# EAGLE schematic vr44-aka-companion (EAGLE 9.6.2)

## Sheet 1 of 3
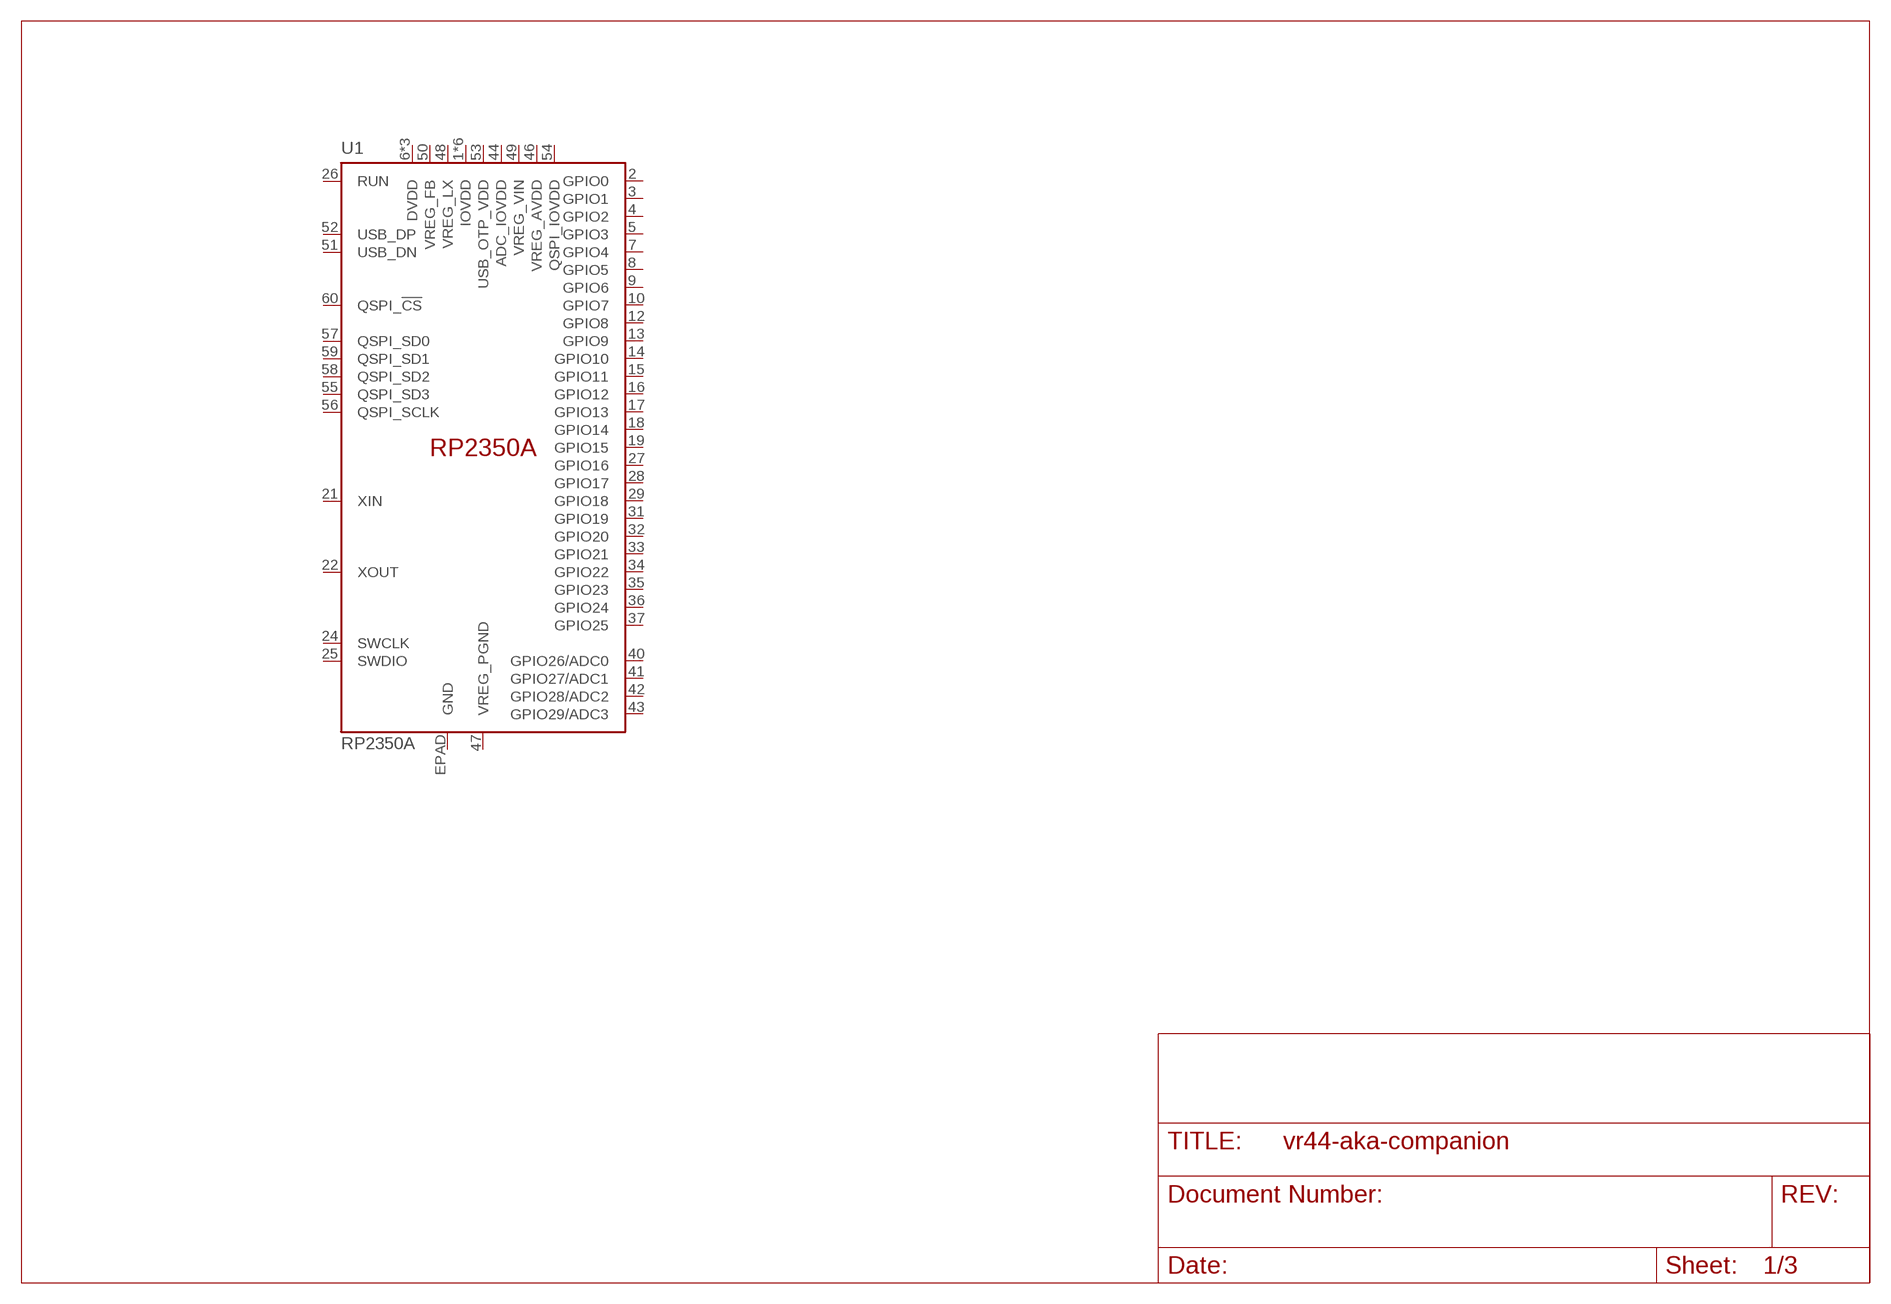
[diagram p0: schematic, sheet 1]

### Parts
U1  RP2350A  [QFN-60]
Unconnected: U1.1(IOVDD) U1.2(GPIO0) U1.3(GPIO1) U1.4(GPIO2) U1.5(GPIO3) U1.6(DVDD) U1.7(GPIO4) U1.8(GPIO5) U1.9(GPIO6) U1.10(GPIO7) U1.11(IOVDD) U1.12(GPIO8) U1.13(GPIO9) U1.14(GPIO10) U1.15(GPIO11) U1.16(GPIO12) U1.17(GPIO13) U1.18(GPIO14) U1.19(GPIO15) U1.20(IOVDD) U1.21(XIN) U1.22(XOUT) U1.23(DVDD) U1.24(SWCLK) U1.25(SWDIO) U1.26(RUN) U1.27(GPIO16) U1.28(GPIO17) U1.29(GPIO18) U1.30(IOVDD) U1.31(GPIO19) U1.32(GPIO20) U1.33(GPIO21) U1.34(GPIO22) U1.35(GPIO23) U1.36(GPIO24) U1.37(GPIO25) U1.38(IOVDD) U1.39(DVDD) U1.40(GPIO26/ADC0) U1.41(GPIO27/ADC1) U1.42(GPIO28/ADC2) U1.43(GPIO29/ADC3) U1.44(ADC_IOVDD) U1.45(IOVDD) U1.46(VREG_AVDD) U1.47(VREG_PGND) U1.48(VREG_LX) U1.49(VREG_VIN) U1.50(VREG_FB) U1.51(USB_DN) U1.52(USB_DP) U1.53(USB_OTP_VDD) U1.54(QSPI_IOVDD) U1.55(QSPI_SD3) U1.56(QSPI_SCLK) U1.57(QSPI_SD0) U1.58(QSPI_SD2) U1.59(QSPI_SD1) U1.60(QSPI_!CS!) U1.EPAD(GND)

## Sheet 2 of 3
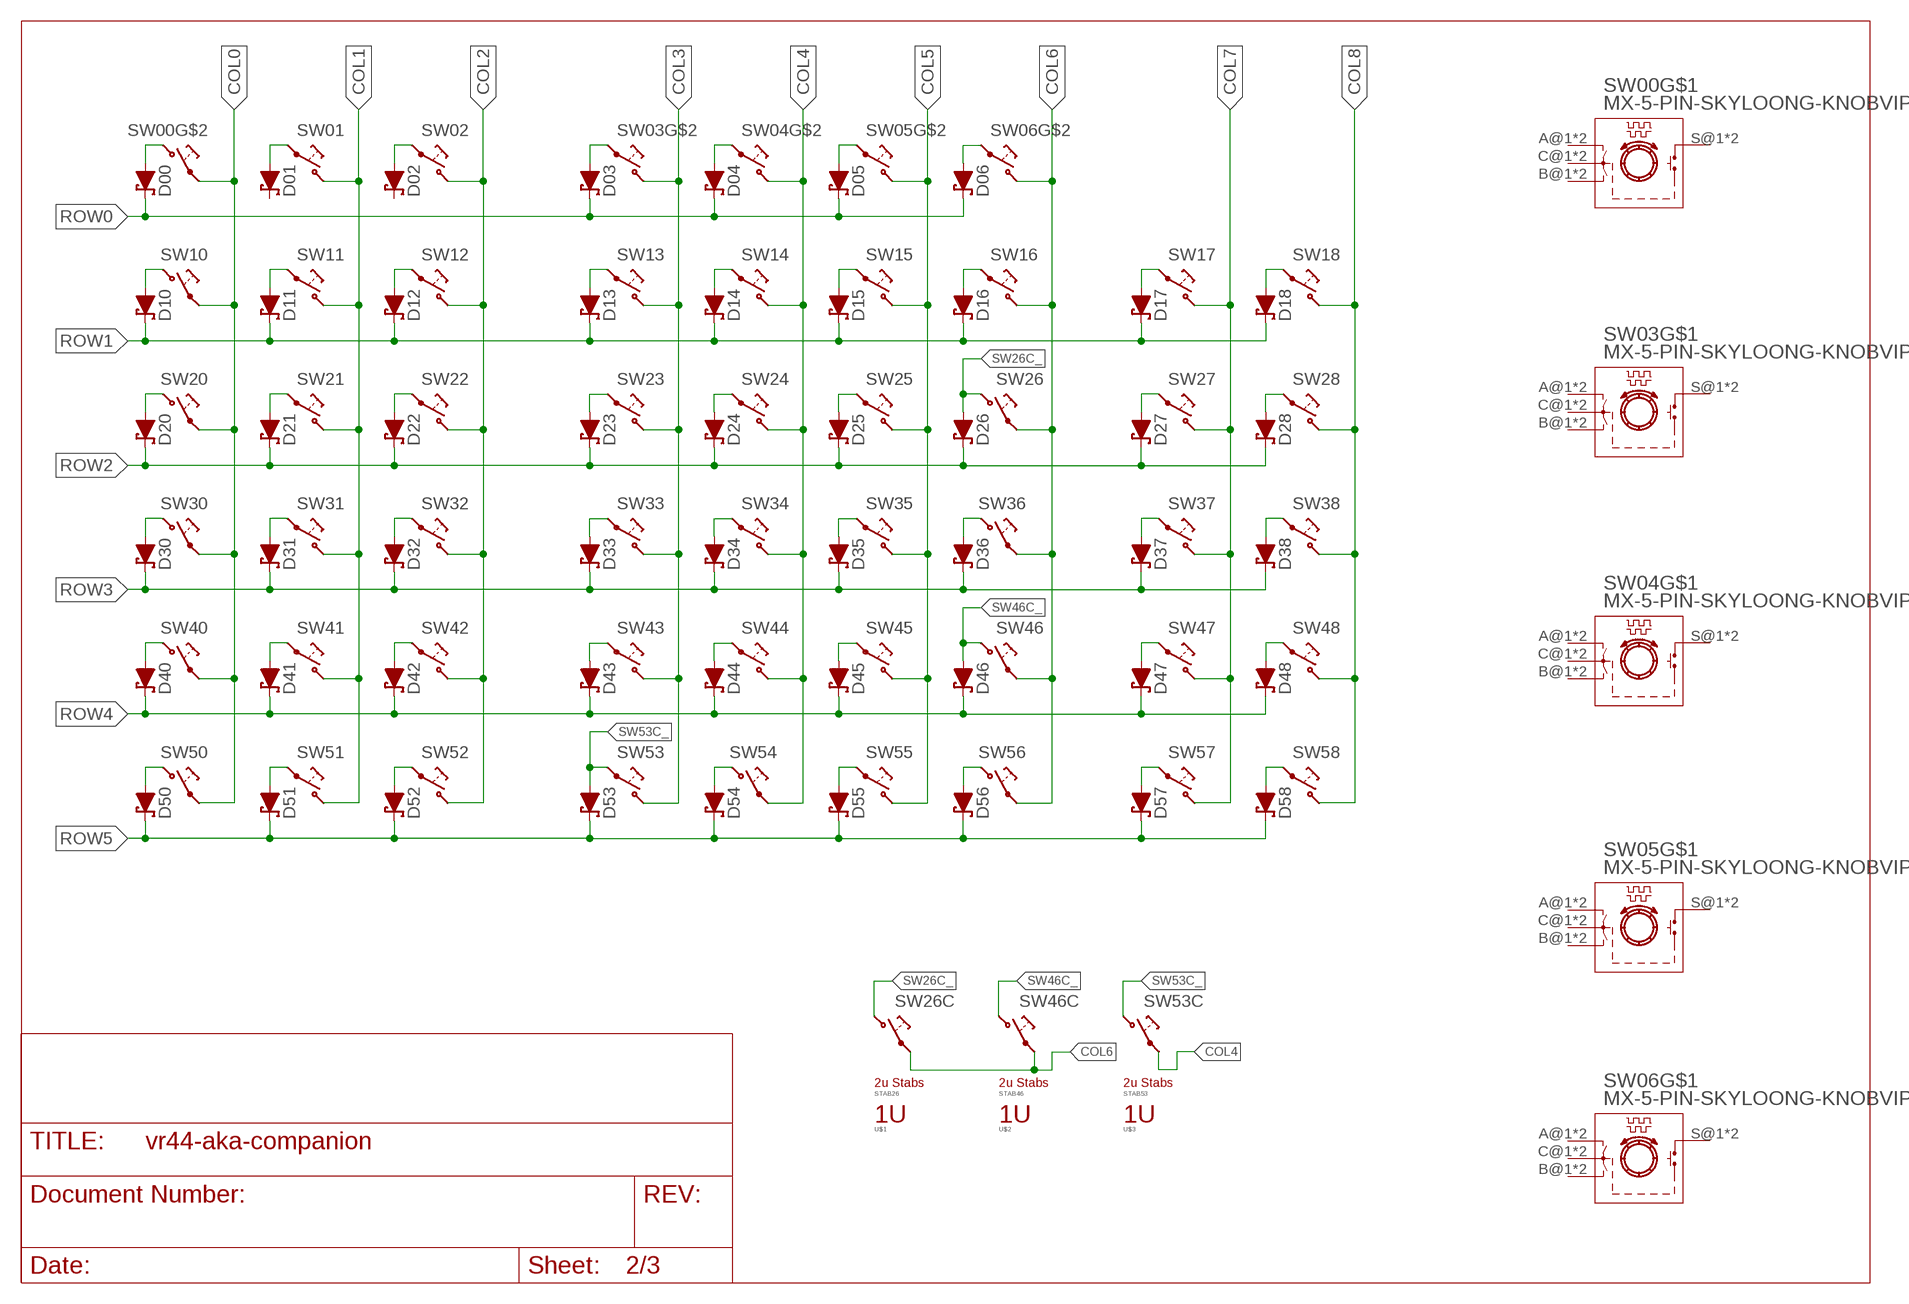
[diagram p1: schematic, sheet 2]

### Parts
D00  1N5819WS  [SOD-123]
D01  1N5819WS  [SOD-123]
D02  1N5819WS  [SOD-123]
D03  1N5819WS  [SOD-123]
D04  1N5819WS  [SOD-123]
D05  1N5819WS  [SOD-123]
D06  1N5819WS  [SOD-123]
D10  1N5819WS  [SOD-123]
D11  1N5819WS  [SOD-123]
D12  1N5819WS  [SOD-123]
D13  1N5819WS  [SOD-123]
D14  1N5819WS  [SOD-123]
D15  1N5819WS  [SOD-123]
D16  1N5819WS  [SOD-123]
D17  1N5819WS  [SOD-123]
D18  1N5819WS  [SOD-123]
D20  1N5819WS  [SOD-123]
D21  1N5819WS  [SOD-123]
D22  1N5819WS  [SOD-123]
D23  1N5819WS  [SOD-123]
D24  1N5819WS  [SOD-123]
D25  1N5819WS  [SOD-123]
D26  1N5819WS  [SOD-123]
D27  1N5819WS  [SOD-123]
D28  1N5819WS  [SOD-123]
D30  1N5819WS  [SOD-123]
D31  1N5819WS  [SOD-123]
D32  1N5819WS  [SOD-123]
D33  1N5819WS  [SOD-123]
D34  1N5819WS  [SOD-123]
D35  1N5819WS  [SOD-123]
D36  1N5819WS  [SOD-123]
D37  1N5819WS  [SOD-123]
D38  1N5819WS  [SOD-123]
D40  1N5819WS  [SOD-123]
D41  1N5819WS  [SOD-123]
D42  1N5819WS  [SOD-123]
D43  1N5819WS  [SOD-123]
D44  1N5819WS  [SOD-123]
D45  1N5819WS  [SOD-123]
D46  1N5819WS  [SOD-123]
D47  1N5819WS  [SOD-123]
D48  1N5819WS  [SOD-123]
D50  1N5819WS  [SOD-123]
D51  1N5819WS  [SOD-123]
D52  1N5819WS  [SOD-123]
D53  1N5819WS  [SOD-123]
D54  1N5819WS  [SOD-123]
D55  1N5819WS  [SOD-123]
D56  1N5819WS  [SOD-123]
D57  1N5819WS  [SOD-123]
D58  1N5819WS  [SOD-123]
STAB26  MX-STABS-200U  [MX-STABS-200U]
STAB46  MX-STABS-200U  [MX-STABS-200U]
STAB53  MX-STABS-200U  [MX-STABS-200U]
SW00  MX-5-PIN-SKYLOONG-KNOBVIP  [MX-5-PIN-SKYLOONG-KNOB-VIP]
SW01  MX-5-PIN-HOTSWAP-VIAVIP  [MX-5-PIN-HOTSWAP-VIA+VIP-NS]
SW02  MX-5-PIN-HOTSWAP-VIAVIP  [MX-5-PIN-HOTSWAP-VIA+VIP-NS]
SW03  MX-5-PIN-SKYLOONG-KNOBVIP  [MX-5-PIN-SKYLOONG-KNOB-VIP]
SW04  MX-5-PIN-SKYLOONG-KNOBVIP  [MX-5-PIN-SKYLOONG-KNOB-VIP]
SW05  MX-5-PIN-SKYLOONG-KNOBVIP  [MX-5-PIN-SKYLOONG-KNOB-VIP]
SW06  MX-5-PIN-SKYLOONG-KNOBVIP  [MX-5-PIN-SKYLOONG-KNOB-VIP]
SW10  MX-5-PIN-HOTSWAP-VIAVIP  [MX-5-PIN-HOTSWAP-VIA+VIP-NS]
SW11  MX-5-PIN-HOTSWAP-VIAVIP  [MX-5-PIN-HOTSWAP-VIA+VIP-NS]
SW12  MX-5-PIN-HOTSWAP-VIAVIP  [MX-5-PIN-HOTSWAP-VIA+VIP-NS]
SW13  MX-5-PIN-HOTSWAP-VIAVIP  [MX-5-PIN-HOTSWAP-VIA+VIP-NS]
SW14  MX-5-PIN-HOTSWAP-VIAVIP  [MX-5-PIN-HOTSWAP-VIA+VIP-NS]
SW15  MX-5-PIN-HOTSWAP-VIAVIP  [MX-5-PIN-HOTSWAP-VIA+VIP-NS]
SW16  MX-5-PIN-HOTSWAP-VIAVIP  [MX-5-PIN-HOTSWAP-VIA+VIP-NS]
SW17  MX-5-PIN-HOTSWAP-VIAVIP  [MX-5-PIN-HOTSWAP-VIA+VIP-NS]
SW18  MX-5-PIN-HOTSWAP-VIAVIP  [MX-5-PIN-HOTSWAP-VIA+VIP-NS]
SW20  MX-5-PIN-HOTSWAP-VIAVIP  [MX-5-PIN-HOTSWAP-VIA+VIP-NS]
SW21  MX-5-PIN-HOTSWAP-VIAVIP  [MX-5-PIN-HOTSWAP-VIA+VIP-NS]
SW22  MX-5-PIN-HOTSWAP-VIAVIP  [MX-5-PIN-HOTSWAP-VIA+VIP-NS]
SW23  MX-5-PIN-HOTSWAP-VIAVIP  [MX-5-PIN-HOTSWAP-VIA+VIP-NS]
SW24  MX-5-PIN-HOTSWAP-VIAVIP  [MX-5-PIN-HOTSWAP-VIA+VIP-NS]
SW25  MX-5-PIN-HOTSWAP-VIAVIP  [MX-5-PIN-HOTSWAP-VIA+VIP-NS]
SW26  MX-5-PIN-HOTSWAP-VIAVIP  [MX-5-PIN-HOTSWAP-VIA+VIP-NS]
SW26C  MX-5-PIN-HOTSWAP-VIAVIP  [MX-5-PIN-HOTSWAP-VIA+VIP-NS]
SW27  MX-5-PIN-HOTSWAP-VIAVIP  [MX-5-PIN-HOTSWAP-VIA+VIP-NS]
SW28  MX-5-PIN-HOTSWAP-VIAVIP  [MX-5-PIN-HOTSWAP-VIA+VIP-NS]
SW30  MX-5-PIN-HOTSWAP-VIAVIP  [MX-5-PIN-HOTSWAP-VIA+VIP-NS]
SW31  MX-5-PIN-HOTSWAP-VIAVIP  [MX-5-PIN-HOTSWAP-VIA+VIP-NS]
SW32  MX-5-PIN-HOTSWAP-VIAVIP  [MX-5-PIN-HOTSWAP-VIA+VIP-NS]
SW33  MX-5-PIN-HOTSWAP-VIAVIP  [MX-5-PIN-HOTSWAP-VIA+VIP-NS]
SW34  MX-5-PIN-HOTSWAP-VIAVIP  [MX-5-PIN-HOTSWAP-VIA+VIP-NS]
SW35  MX-5-PIN-HOTSWAP-VIAVIP  [MX-5-PIN-HOTSWAP-VIA+VIP-NS]
SW36  MX-5-PIN-HOTSWAP-VIAVIP  [MX-5-PIN-HOTSWAP-VIA+VIP-NS]
SW37  MX-5-PIN-HOTSWAP-VIAVIP  [MX-5-PIN-HOTSWAP-VIA+VIP-NS]
SW38  MX-5-PIN-HOTSWAP-VIAVIP  [MX-5-PIN-HOTSWAP-VIA+VIP-NS]
SW40  MX-5-PIN-HOTSWAP-VIAVIP  [MX-5-PIN-HOTSWAP-VIA+VIP-NS]
SW41  MX-5-PIN-HOTSWAP-VIAVIP  [MX-5-PIN-HOTSWAP-VIA+VIP-NS]
SW42  MX-5-PIN-HOTSWAP-VIAVIP  [MX-5-PIN-HOTSWAP-VIA+VIP-NS]
SW43  MX-5-PIN-HOTSWAP-VIAVIP  [MX-5-PIN-HOTSWAP-VIA+VIP-NS]
SW44  MX-5-PIN-HOTSWAP-VIAVIP  [MX-5-PIN-HOTSWAP-VIA+VIP-NS]
SW45  MX-5-PIN-HOTSWAP-VIAVIP  [MX-5-PIN-HOTSWAP-VIA+VIP-NS]
SW46  MX-5-PIN-HOTSWAP-VIAVIP  [MX-5-PIN-HOTSWAP-VIA+VIP-NS]
SW46C  MX-5-PIN-HOTSWAP-VIAVIP  [MX-5-PIN-HOTSWAP-VIA+VIP-NS]
SW47  MX-5-PIN-HOTSWAP-VIAVIP  [MX-5-PIN-HOTSWAP-VIA+VIP-NS]
SW48  MX-5-PIN-HOTSWAP-VIAVIP  [MX-5-PIN-HOTSWAP-VIA+VIP-NS]
SW50  MX-5-PIN-HOTSWAP-VIAVIP  [MX-5-PIN-HOTSWAP-VIA+VIP-NS]
SW51  MX-5-PIN-HOTSWAP-VIAVIP  [MX-5-PIN-HOTSWAP-VIA+VIP-NS]
SW52  MX-5-PIN-HOTSWAP-VIAVIP  [MX-5-PIN-HOTSWAP-VIA+VIP-NS]
SW53  MX-5-PIN-HOTSWAP-VIAVIP  [MX-5-PIN-HOTSWAP-VIA+VIP-NS]
SW53C  MX-5-PIN-HOTSWAP-VIAVIP  [MX-5-PIN-HOTSWAP-VIA+VIP-NS]
SW54  MX-5-PIN-HOTSWAP-VIAVIP  [MX-5-PIN-HOTSWAP-VIA+VIP-NS]
SW55  MX-5-PIN-HOTSWAP-VIAVIP  [MX-5-PIN-HOTSWAP-VIA+VIP-NS]
SW56  MX-5-PIN-HOTSWAP-VIAVIP  [MX-5-PIN-HOTSWAP-VIA+VIP-NS]
SW57  MX-5-PIN-HOTSWAP-VIAVIP  [MX-5-PIN-HOTSWAP-VIA+VIP-NS]
SW58  MX-5-PIN-HOTSWAP-VIAVIP  [MX-5-PIN-HOTSWAP-VIA+VIP-NS]
U$1  MX-FPRINT-100U-PLACE  [MX-FPRINT-PLACE-100U]
U$2  MX-FPRINT-100U-PLACE  [MX-FPRINT-PLACE-100U]
U$3  MX-FPRINT-100U-PLACE  [MX-FPRINT-PLACE-100U]

### Nets
COL0: SW00.1@1 SW00.1@2 SW00.1@3 SW10.1@1 SW10.1@2 SW10.1@3 SW20.1@1 SW20.1@2 SW20.1@3 SW30.1@1 SW30.1@2 SW30.1@3 SW40.1@1 SW40.1@2 SW40.1@3 SW50.1@1 SW50.1@2 SW50.1@3
COL1: SW01.2@1 SW01.2@2 SW01.2@3 SW11.2@1 SW11.2@2 SW11.2@3 SW21.2@1 SW21.2@2 SW21.2@3 SW31.2@1 SW31.2@2 SW31.2@3 SW41.2@1 SW41.2@2 SW41.2@3 SW51.2@1 SW51.2@2 SW51.2@3
COL2: SW02.2@1 SW02.2@2 SW02.2@3 SW12.2@1 SW12.2@2 SW12.2@3 SW22.2@1 SW22.2@2 SW22.2@3 SW32.2@1 SW32.2@2 SW32.2@3 SW42.2@1 SW42.2@2 SW42.2@3 SW52.2@1 SW52.2@2 SW52.2@3
COL3: SW03.2@1 SW03.2@2 SW03.2@3 SW13.2@1 SW13.2@2 SW13.2@3 SW23.2@1 SW23.2@2 SW23.2@3 SW33.2@1 SW33.2@2 SW33.2@3 SW43.2@1 SW43.2@2 SW43.2@3 SW53.2@1 SW53.2@2 SW53.2@3
COL4: SW04.2@1 SW04.2@2 SW04.2@3 SW14.2@1 SW14.2@2 SW14.2@3 SW24.2@1 SW24.2@2 SW24.2@3 SW34.2@1 SW34.2@2 SW34.2@3 SW44.2@1 SW44.2@2 SW44.2@3 SW53C.1@1 SW53C.1@2 SW53C.1@3 SW54.1@1 SW54.1@2 SW54.1@3
COL5: SW05.2@1 SW05.2@2 SW05.2@3 SW15.2@1 SW15.2@2 SW15.2@3 SW25.2@1 SW25.2@2 SW25.2@3 SW35.2@1 SW35.2@2 SW35.2@3 SW45.2@1 SW45.2@2 SW45.2@3 SW55.2@1 SW55.2@2 SW55.2@3
COL6: SW06.2@1 SW06.2@2 SW06.2@3 SW16.2@1 SW16.2@2 SW16.2@3 SW26.1@1 SW26.1@2 SW26.1@3 SW26C.1@1 SW26C.1@2 SW26C.1@3 SW36.1@1 SW36.1@2 SW36.1@3 SW46.1@1 SW46.1@2 SW46.1@3 SW46C.1@1 SW46C.1@2 SW46C.1@3 SW56.1@1 SW56.1@2 SW56.1@3
COL7: SW17.2@1 SW17.2@2 SW17.2@3 SW27.2@1 SW27.2@2 SW27.2@3 SW37.2@1 SW37.2@2 SW37.2@3 SW47.2@1 SW47.2@2 SW47.2@3 SW57.2@1 SW57.2@2 SW57.2@3
COL8: SW18.2@1 SW18.2@2 SW18.2@3 SW28.2@1 SW28.2@2 SW28.2@3 SW38.2@1 SW38.2@2 SW38.2@3 SW48.2@1 SW48.2@2 SW48.2@3 SW58.2@1 SW58.2@2 SW58.2@3
N$1: D00.A SW00.2@1 SW00.2@2 SW00.2@3
N$2: D01.A SW01.1@1 SW01.1@2 SW01.1@3
N$3: D02.A SW02.1@1 SW02.1@2 SW02.1@3
N$4: D55.A SW55.1@1 SW55.1@2 SW55.1@3
N$5: D54.A SW54.2@1 SW54.2@2 SW54.2@3
N$6: D56.A SW56.2@1 SW56.2@2 SW56.2@3
N$7: D28.A SW28.1@1 SW28.1@2 SW28.1@3
N$8: D36.A SW36.2@1 SW36.2@2 SW36.2@3
N$9: D03.A SW03.1@1 SW03.1@2 SW03.1@3
N$10: D04.A SW04.1@1 SW04.1@2 SW04.1@3
N$11: D05.A SW05.1@1 SW05.1@2 SW05.1@3
N$12: D06.A SW06.1@1 SW06.1@2 SW06.1@3
N$13: D16.A SW16.1@1 SW16.1@2 SW16.1@3
N$14: D15.A SW15.1@1 SW15.1@2 SW15.1@3
N$15: D14.A SW14.1@1 SW14.1@2 SW14.1@3
N$16: D13.A SW13.1@1 SW13.1@2 SW13.1@3
N$17: D12.A SW12.1@1 SW12.1@2 SW12.1@3
N$18: D11.A SW11.1@1 SW11.1@2 SW11.1@3
N$19: D10.A SW10.2@1 SW10.2@2 SW10.2@3
N$20: D27.A SW27.1@1 SW27.1@2 SW27.1@3
N$21: D37.A SW37.1@1 SW37.1@2 SW37.1@3
N$22: D47.A SW47.1@1 SW47.1@2 SW47.1@3
N$23: D57.A SW57.1@1 SW57.1@2 SW57.1@3
N$24: D58.A SW58.1@1 SW58.1@2 SW58.1@3
N$25: D48.A SW48.1@1 SW48.1@2 SW48.1@3
N$26: D17.A SW17.1@1 SW17.1@2 SW17.1@3
N$27: D18.A SW18.1@1 SW18.1@2 SW18.1@3
N$28: D38.A SW38.1@1 SW38.1@2 SW38.1@3
N$29: D45.A SW45.1@1 SW45.1@2 SW45.1@3
N$30: D44.A SW44.1@1 SW44.1@2 SW44.1@3
N$31: D43.A SW43.1@1 SW43.1@2 SW43.1@3
N$32: D33.A SW33.1@1 SW33.1@2 SW33.1@3
N$33: D34.A SW34.1@1 SW34.1@2 SW34.1@3
N$34: D35.A SW35.1@1 SW35.1@2 SW35.1@3
N$35: D25.A SW25.1@1 SW25.1@2 SW25.1@3
N$36: D24.A SW24.1@1 SW24.1@2 SW24.1@3
N$37: D23.A SW23.1@1 SW23.1@2 SW23.1@3
N$38: D20.A SW20.2@1 SW20.2@2 SW20.2@3
N$39: D30.A SW30.2@1 SW30.2@2 SW30.2@3
N$40: D40.A SW40.2@1 SW40.2@2 SW40.2@3
N$41: D50.A SW50.2@1 SW50.2@2 SW50.2@3
N$42: D21.A SW21.1@1 SW21.1@2 SW21.1@3
N$43: D22.A SW22.1@1 SW22.1@2 SW22.1@3
N$44: D31.A SW31.1@1 SW31.1@2 SW31.1@3
N$45: D32.A SW32.1@1 SW32.1@2 SW32.1@3
N$46: D42.A SW42.1@1 SW42.1@2 SW42.1@3
N$47: D41.A SW41.1@1 SW41.1@2 SW41.1@3
N$48: D51.A SW51.1@1 SW51.1@2 SW51.1@3
N$49: D52.A SW52.1@1 SW52.1@2 SW52.1@3
ROW0: D00.C D03.C D04.C D05.C D06.C
ROW1: D10.C D11.C D12.C D13.C D14.C D15.C D16.C D17.C D18.C
ROW2: D20.C D21.C D22.C D23.C D24.C D25.C D26.C D27.C D28.C
ROW3: D30.C D31.C D32.C D33.C D34.C D35.C D36.C D37.C D38.C
ROW4: D40.C D41.C D42.C D43.C D44.C D45.C D46.C D47.C D48.C
ROW5: D50.C D51.C D52.C D53.C D54.C D55.C D56.C D57.C D58.C
SW26C_: D26.A SW26.2@1 SW26.2@2 SW26.2@3 SW26C.2@1 SW26C.2@2 SW26C.2@3
SW46C_: D46.A SW46.2@1 SW46.2@2 SW46.2@3 SW46C.2@1 SW46C.2@2 SW46C.2@3
SW53C_: D53.A SW53.1@1 SW53.1@2 SW53.1@3 SW53C.2@1 SW53C.2@2 SW53C.2@3
Unconnected: D01.C D02.C SW00.A@1(A) SW00.A@2(A) SW00.B@1(B) SW00.B@2(B) SW00.C@1(C) SW00.C@2(C) SW00.S@1(S) SW00.S@2(S) SW03.A@1(A) SW03.A@2(A) SW03.B@1(B) SW03.B@2(B) SW03.C@1(C) SW03.C@2(C) SW03.S@1(S) SW03.S@2(S) SW04.A@1(A) SW04.A@2(A) SW04.B@1(B) SW04.B@2(B) SW04.C@1(C) SW04.C@2(C) SW04.S@1(S) SW04.S@2(S) SW05.A@1(A) SW05.A@2(A) SW05.B@1(B) SW05.B@2(B) SW05.C@1(C) SW05.C@2(C) SW05.S@1(S) SW05.S@2(S) SW06.A@1(A) SW06.A@2(A) SW06.B@1(B) SW06.B@2(B) SW06.C@1(C) SW06.C@2(C) SW06.S@1(S) SW06.S@2(S)

## Sheet 3 of 3
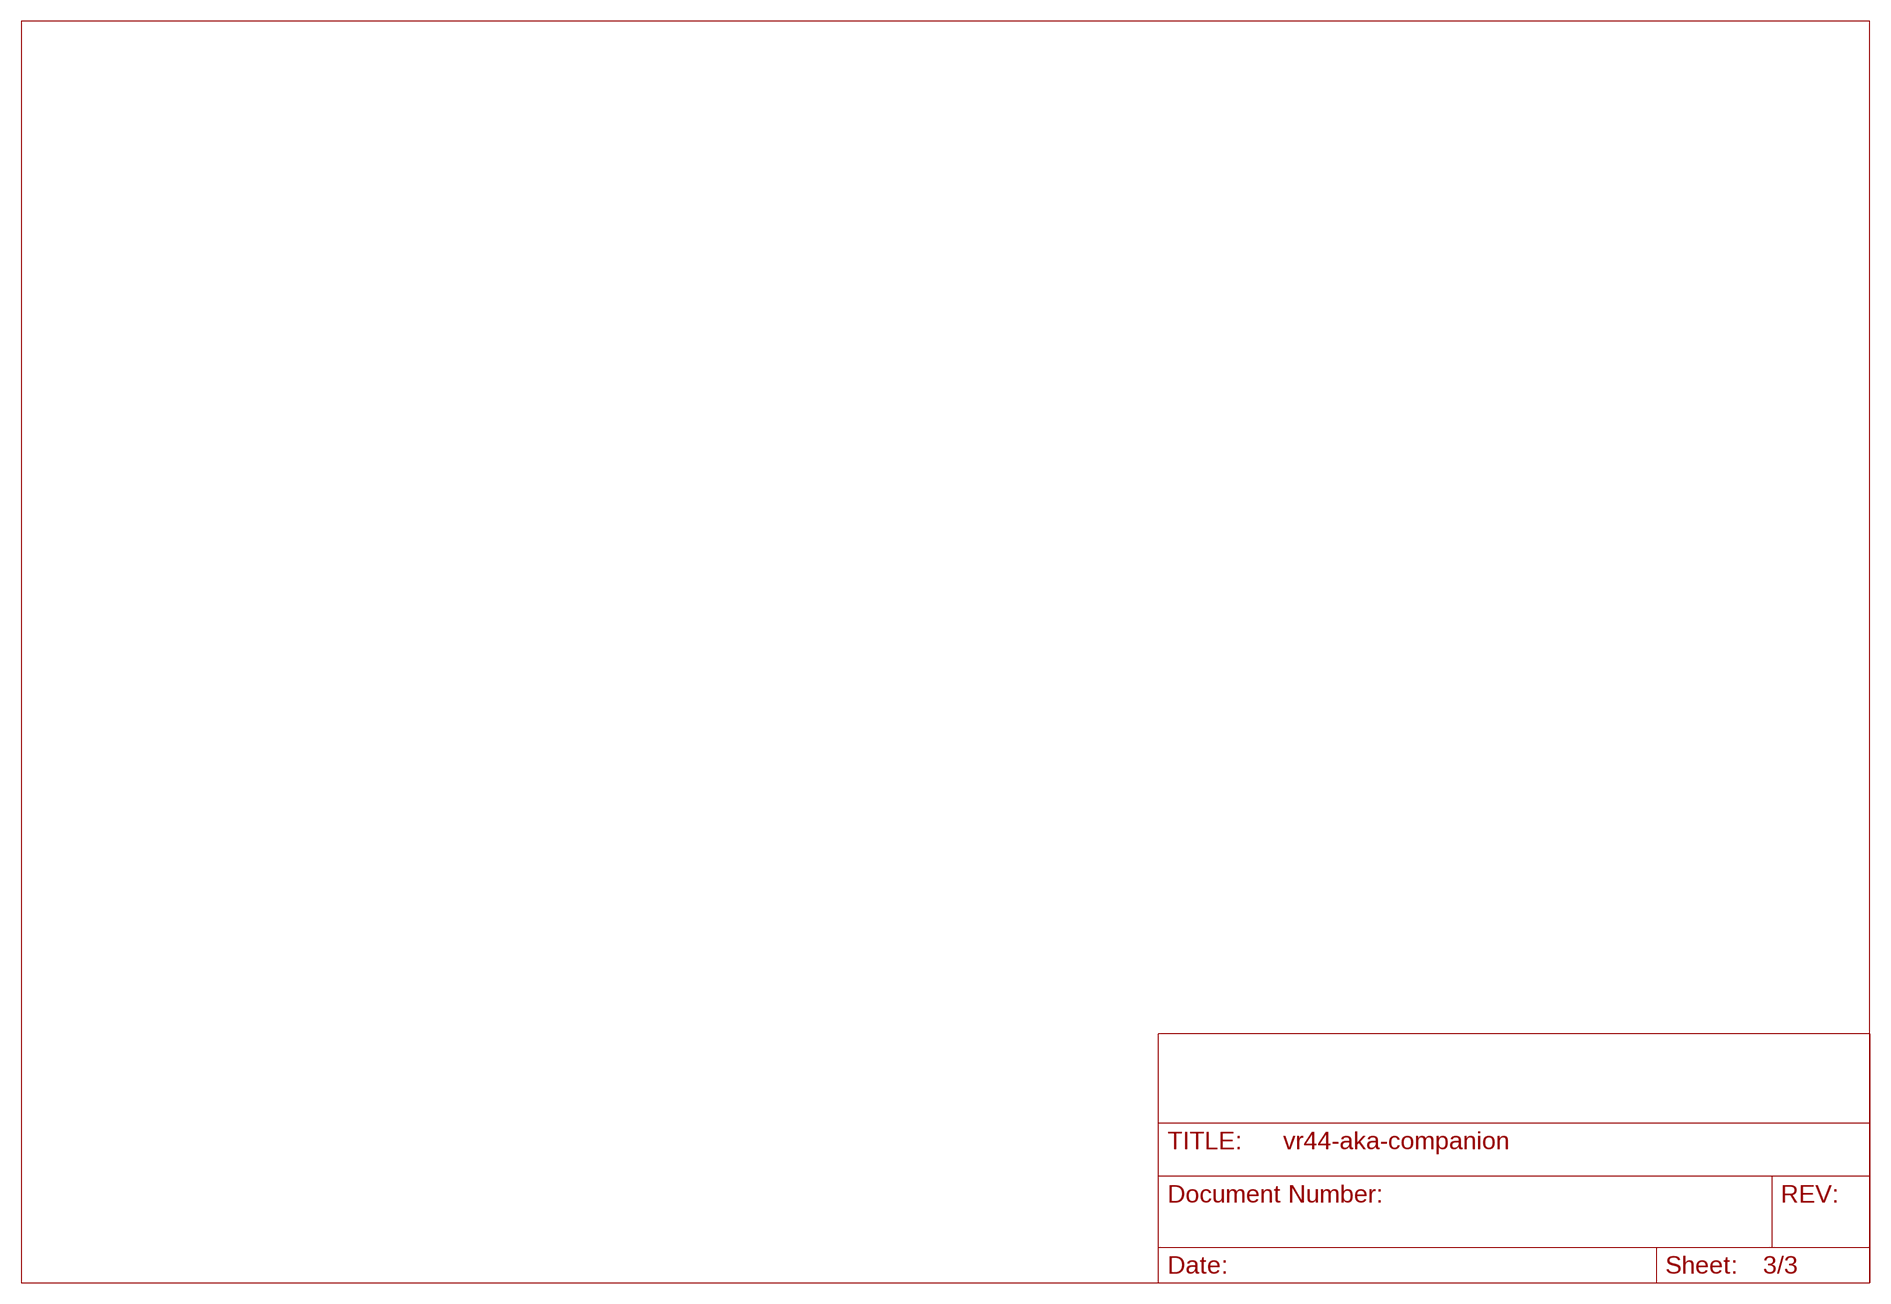
[diagram p2: schematic, sheet 3]

## Library data of the parts
D00 D01-D06 D10-D18 D20-D28 D30-D38 D40-D48 D50-D58 = jlcpcb_basic_parts:1N5819WS: JLCPCB Part # C8598 Description 40V 600mV@1A 1A SOD-123 Schottky Barrier Diodes (SBD) ROHS Schottky Diode
STAB26 STAB46 STAB53 = ts_keyboards:MX-STABS-200U
SW00 SW03-SW06 = ts_keyboards:MX-5-PIN-SKYLOONG-KNOB
SW01 SW02 SW10-SW18 SW20-SW26 SW26C SW27 SW28 SW30-SW38 SW40-SW46 SW46C SW47 SW48 SW50-SW53 SW53C SW54-SW58 = ts_keyboards:MX-5-PIN-HOTSWAP-VIA
U1 = rpi:RP2350A: Raspberry Pi RP2350A MCU; PROD_ID: IC-21276
U$1-U$3 = ts_keyboards:MX-FPRINT-100U